# Altium schematic sheet S05-INTERFACES.SchDoc
size B; SheetNumber: 6; SheetTotal: 7; BLOCK-TITLE: SERVO/LED MODULE INTERFACES; BLOCK-SIZE: B; BLOCK-PROJECT: MULTIMOD BASE; BLOCK-REVISION: 1; BLOCK-ORGANIZATION: UNIVERSITY OF FLORIDA; BLOCK-DESIGNER: MEHRON TALEBI; BLOCK-IDENTIFIER: SUMMER 2023; BLOCK-REVIEWER: MIKE STAPLETON
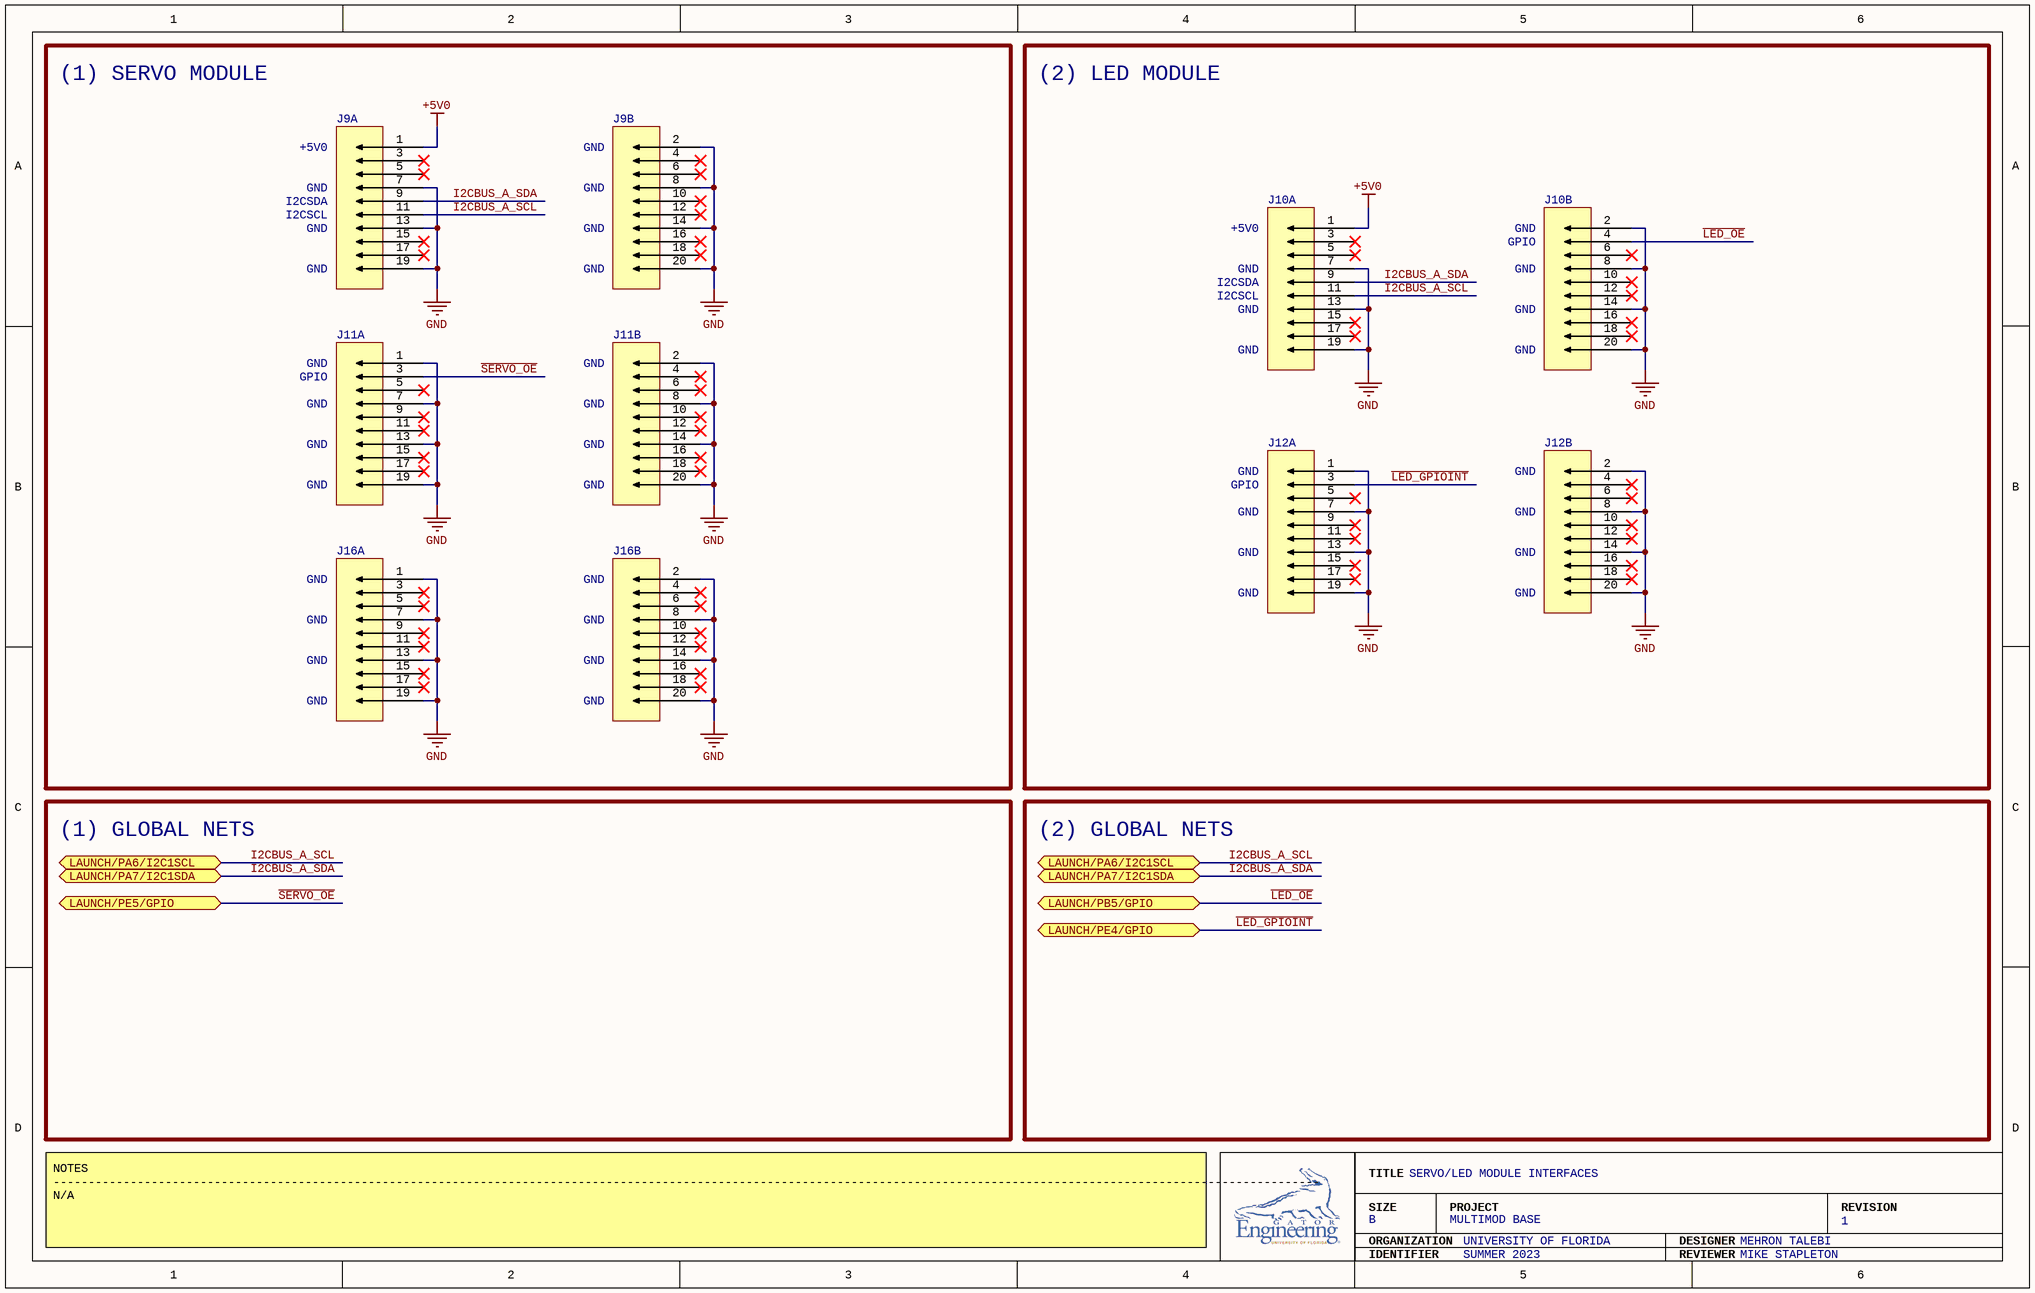
[diagram p0: S05-INTERFACES.SchDoc]

## Parts
J9  95278-101-20LF  [95278-101-20LF]  (value not drawn)  (parts A,B of 2)
J10  95278-101-20LF  [95278-101-20LF]  (value not drawn)  (parts A,B of 2)
J11  95278-101-20LF  [95278-101-20LF]  (value not drawn)  (parts A,B of 2)
J12  95278-101-20LF  [95278-101-20LF]  (value not drawn)  (parts A,B of 2)
J16  95278-101-20LF  [95278-101-20LF]  (value not drawn)  (parts A,B of 2)

## Blocks framed on the sheet
(1) SERVO MODULE: J9 J11 J16
(2) LED MODULE: J10 J12

## Ports
LAUNCH/PA6/I2C1SCL (bidir), LAUNCH/PA7/I2C1SDA (bidir), LAUNCH/PB5/GPIO (bidir), LAUNCH/PE4/GPIO (bidir), LAUNCH/PE5/GPIO (bidir)

## Nets
+5V0: J9.1 J10.1
GND: J9.2 J9.7 J9.8 J9.13 J9.14 J9.19 J9.20 J10.2 J10.7 J10.8 J10.13 J10.14 J10.19 J10.20 J11.1 J11.2 J11.7 J11.8 J11.13 J11.14 J11.19 J11.20 J12.1 J12.2 J12.7 J12.8 J12.13 J12.14 J12.19 J12.20 J16.1 J16.2 J16.7 J16.8 J16.13 J16.14 J16.19 J16.20
~{LED_GPIOINT}: J12.3 ; port LAUNCH/PE4/GPIO
~{LED_OE}: J10.4 ; port LAUNCH/PB5/GPIO
~{SERVO_OE}: J11.3 ; port LAUNCH/PE5/GPIO
I2CBUS_A_SCL: J9.11 J10.11 ; port LAUNCH/PA6/I2C1SCL
I2CBUS_A_SDA: J9.9 J10.9 ; port LAUNCH/PA7/I2C1SDA

Not connected (* = marked no-connect by the designer): J9 3* 4* 5* 6* 10* 12* 15* 16* 17* 18*; J10 3* 5* 6* 10* 12* 15* 16* 17* 18*; J11 4* 5* 6* 9* 10* 11* 12* 15* 16* 17* 18*; J12 4* 5* 6* 9* 10* 11* 12* 15* 16* 17* 18*; J16 3* 4* 5* 6* 9* 10* 11* 12* 15* 16* 17* 18*

## Notes on the sheet
- +5V0
- GND
- I2CSCL
- I2CSDA
- GPIO
- (1) GLOBAL NETS
- (2) GLOBAL NETS
- NOTES
  -------------------------------------------------------------------------------------------------------------------------------------------------------------------------------------
  N/A
- TITLE
- SIZE
- ORGANIZATION
- PROJECT
- DESIGNER
- REVISION
- IDENTIFIER
- REVIEWER

## Library data of the parts
J9-J12 J16 = 95278-101-20LF: CONN HEADER SMD 20POS 2.54MM; Connector Type: Header, Breakaway; Pitch - Mating: 0.100" (2.54mm); Number of Positions: 20; Number of Positions Loaded: All; Style: Board to Board; Shrouding: Unshrouded; Contact Length - Mating: 0.232" (5.90mm); Material Flammability Rating: UL94 V-0; Current Rating (Amps): 3A per Contact; System: Connector; Contact Type: Male Pin; Number of Rows: 2; Row Spacing - Mating: 0.100" (2.54mm); Mounting Type: Surface Mount; Termination: Solder; Fastening Type: Push-Pull; Insulation Height: 0.100" (2.54mm); Contact Shape: Square; Contact Finish - Mating: Gold, GXT™; Contact Finish Thickness - Mating: 30.0µin (0.76µm); Contact Finish - Post: Tin; Contact Material: Phosphor Bronze; Insulation Material: Thermoplastic; Operating Temperature: -65°C ~ 125°C; Insulation Color: Black; Contact Finish Thickness - Post: 78.7µin (2.00µm); Supplier 1: Arrow Electronics; Supplier Part Number 1: 95278-101-20LF